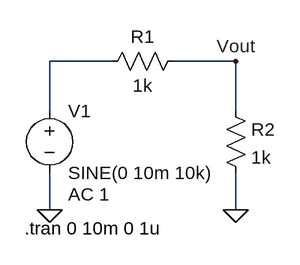
[diagram p0: schematic res_divider.asc]
res_divider.asc, the LTspice schematic file:
Version 4
SHEET 1 880 680
WIRE 144 16 64 16
WIRE 304 16 224 16
WIRE 64 80 64 16
WIRE 304 80 304 16
WIRE 64 208 64 160
WIRE 304 208 304 160
FLAG 304 208 0
FLAG 64 208 0
FLAG 304 16 Vout
SYMBOL res 240 0 R90
WINDOW 0 0 56 VBottom 2
WINDOW 3 32 56 VTop 2
SYMATTR InstName R1
SYMATTR Value 1k
SYMBOL res 288 64 R0
SYMATTR InstName R2
SYMATTR Value 1k
SYMBOL voltage 64 64 R0
WINDOW 123 24 124 Left 2
WINDOW 39 0 0 Left 0
SYMATTR Value2 AC 1
SYMATTR InstName V1
SYMATTR Value SINE(0 10m 10k)
TEXT 32 232 Left 2 !.tran 0 10m 0 1u

The netlist it stands for:
* res_divider.asc
R1 Vout N001 1k
R2 Vout 0 1k
V1 N001 0 SINE(0 10m 10k) AC 1
.tran 0 10m 0 1u
.backanno
.end